# EAGLE schematic lcdTestBoard (EAGLE 7.3.0)
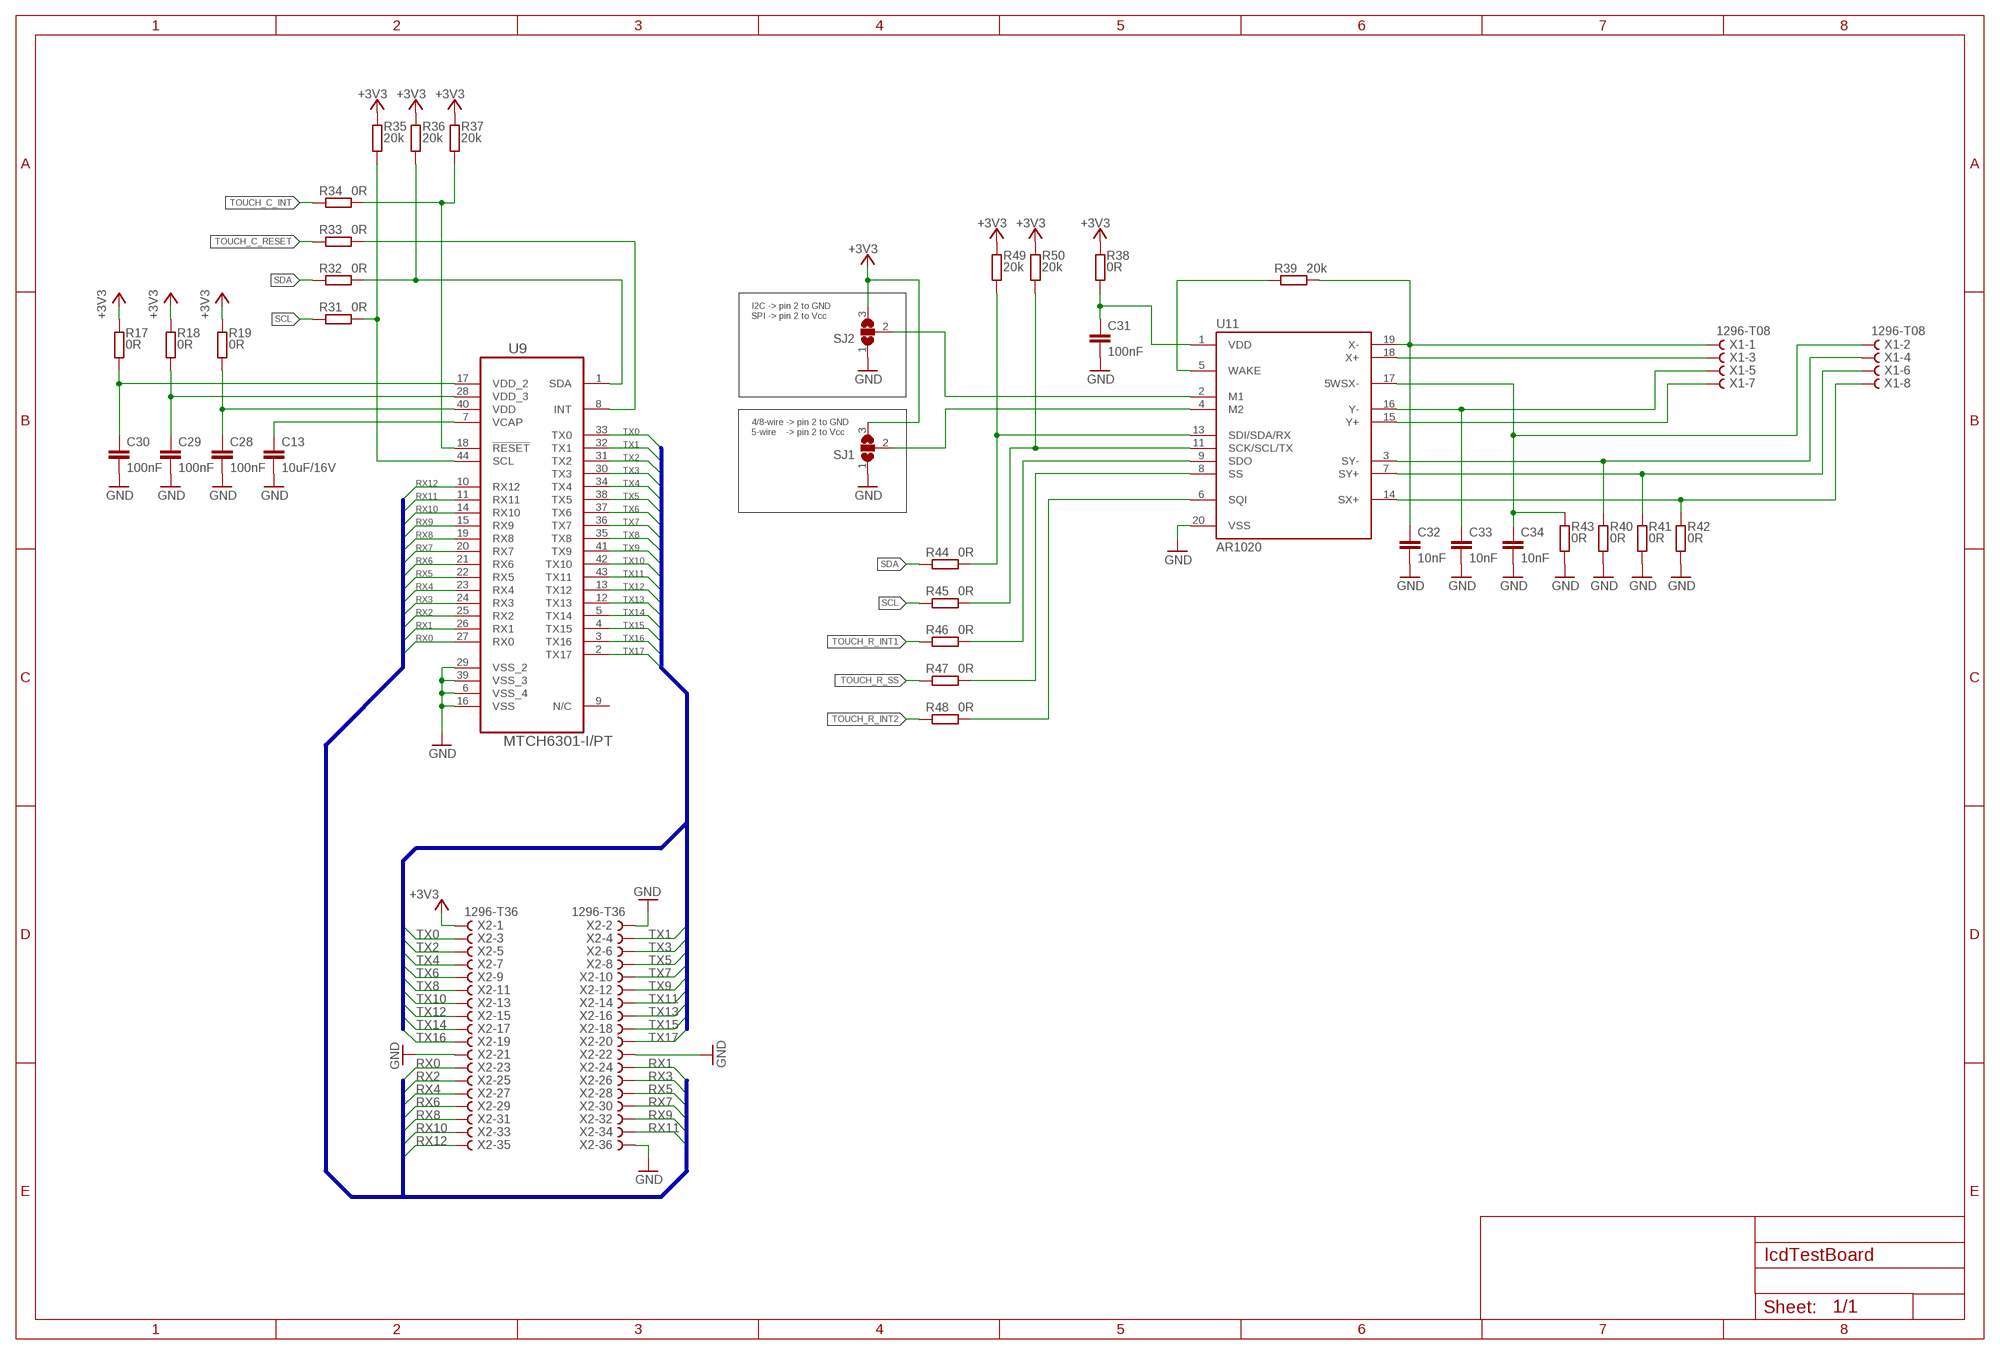
[diagram p0: schematic, sheet 1, part 1 of 3]
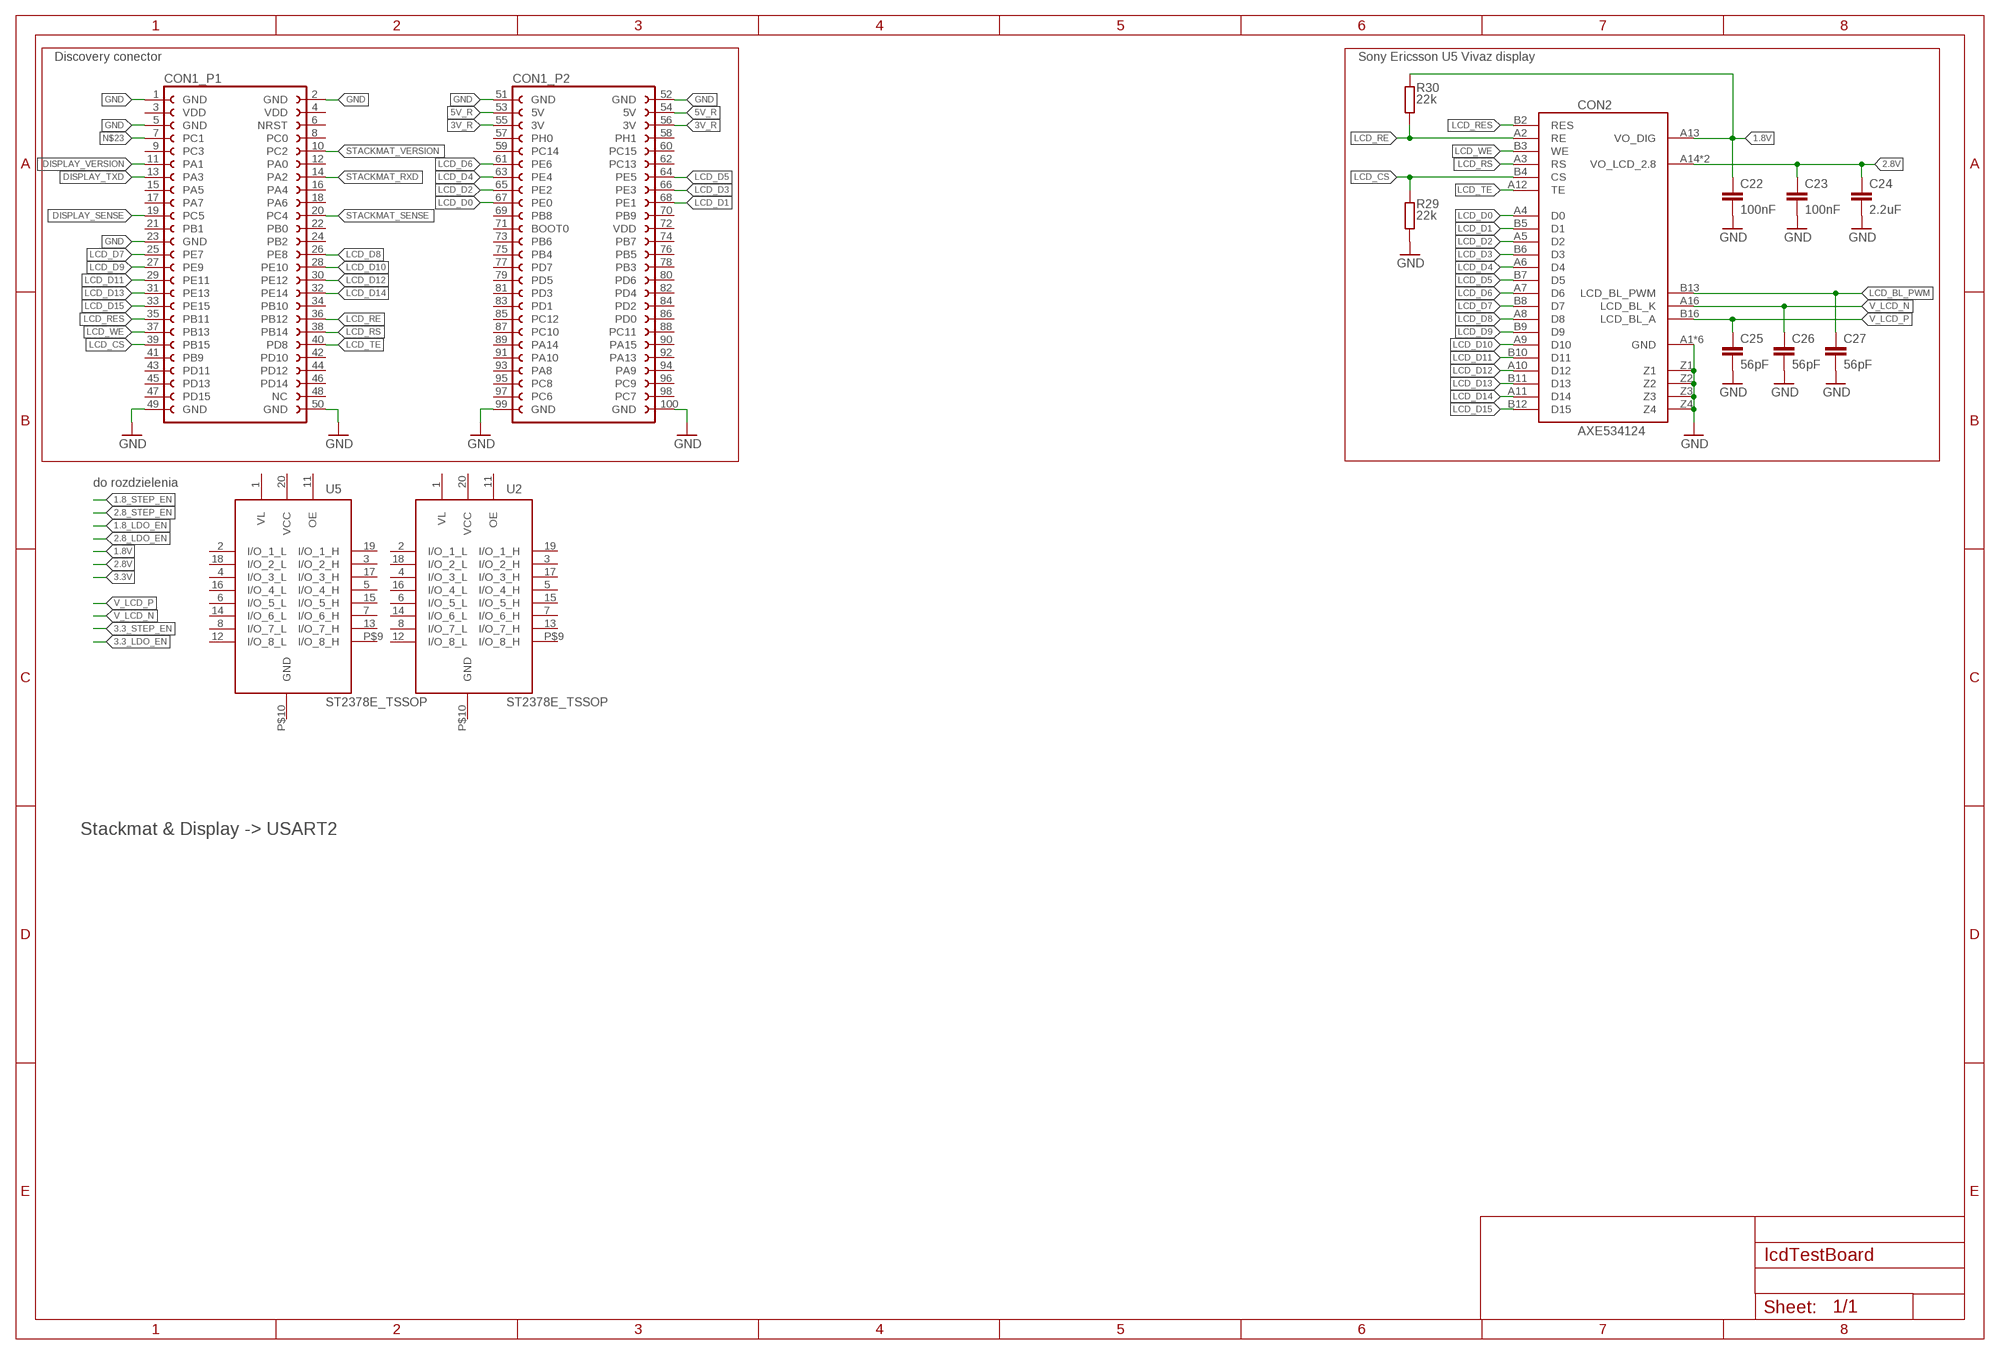
[diagram p1: schematic, sheet 1, part 2 of 3]
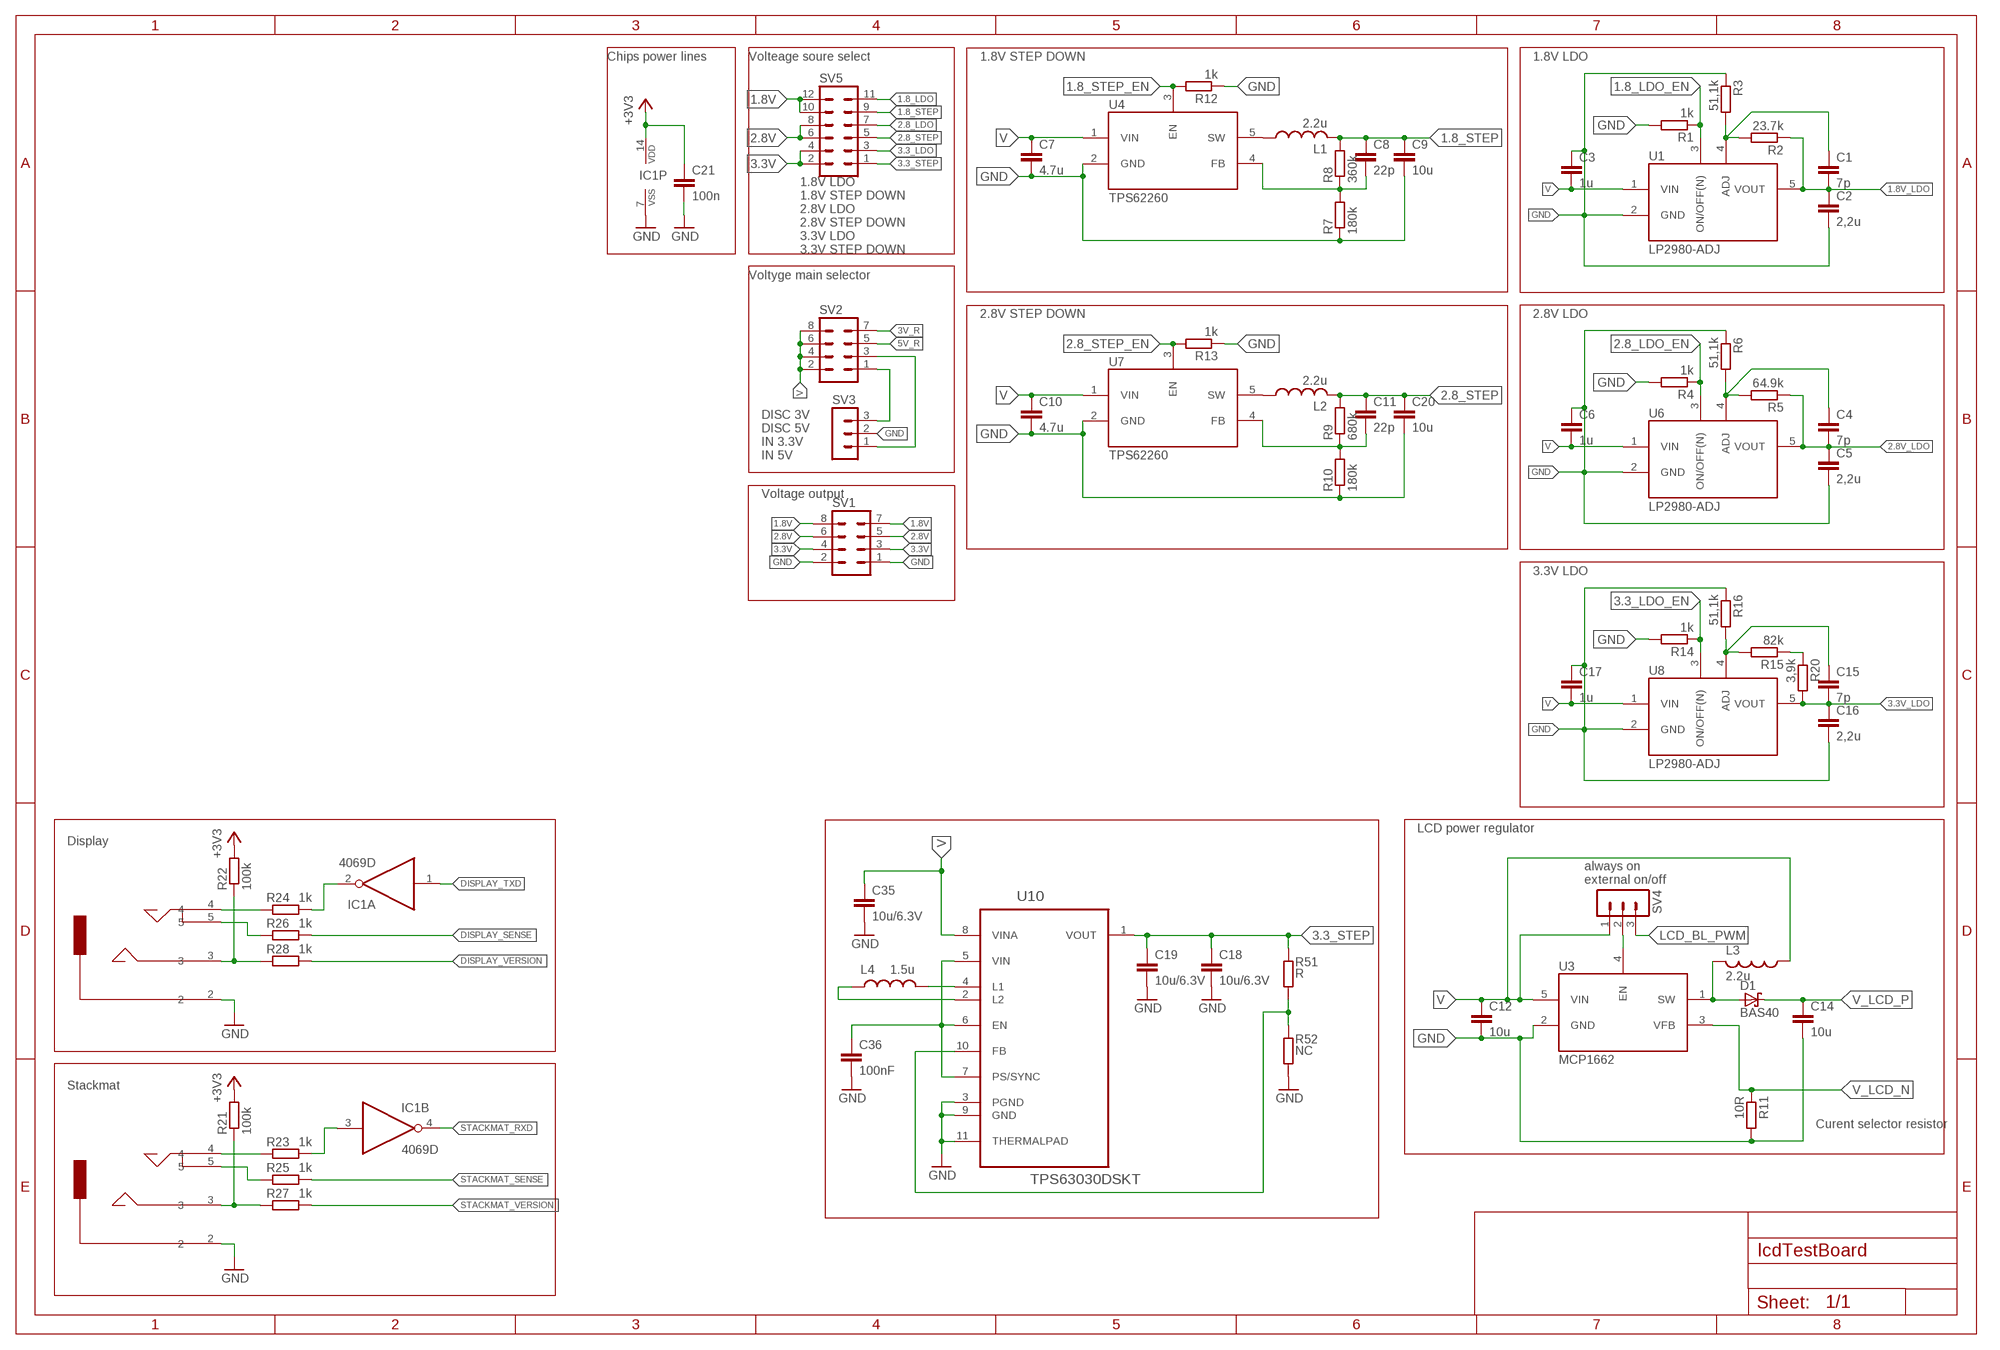
[diagram p2: schematic, sheet 1, part 3 of 3]

## Parts
C1  7p  C-EUC0603  [C0603]
C2  2,2u  C-EUC0603  [C0603]
C3  1u  C-EUC0603  [C0603]
C4  7p  C-EUC0603  [C0603]
C5  2,2u  C-EUC0603  [C0603]
C6  1u  C-EUC0603  [C0603]
C7  4.7u  C-EUC0603  [C0603]
C8  22p  C-EUC0603  [C0603]
C9  10u  C-EUC1206  [C1206]
C10  4.7u  C-EUC0603  [C0603]
C11  22p  C-EUC0603  [C0603]
C12  10u  C-EUC1206  [C1206]
C13  10uF/16V  C-EUC1206K  [C1206K]
C14  10u  C-EUC1206  [C1206]
C15  7p  C-EUC0603  [C0603]
C16  2,2u  C-EUC0603  [C0603]
C17  1u  C-EUC0603  [C0603]
C18  10u/6.3V  C-EUC1206  [C1206]
C19  10u/6.3V  C-EUC1206  [C1206]
C20  10u  C-EUC1206  [C1206]
C21  100n  C-EUC0603K  [C0603K]
C22  100nF  C-EUC0603K  [C0603K]
C23  100nF  C-EUC0603K  [C0603K]
C24  2.2uF  C-EUC0603K  [C0603K]
C25  56pF  C-EUC0603K  [C0603K]
C26  56pF  C-EUC0603K  [C0603K]
C27  56pF  C-EUC0603K  [C0603K]
C28  100nF  C-EUC0603K  [C0603K]
C29  100nF  C-EUC0603K  [C0603K]
C30  100nF  C-EUC0603K  [C0603K]
C31  100nF  C-EUC0603K  [C0603K]
C32  10nF  C-EUC0603K  [C0603K]
C33  10nF  C-EUC0603K  [C0603K]
C34  10nF  C-EUC0603K  [C0603K]
C35  10u/6.3V  C-EUC1206  [C1206]
C36  100nF  C-EUC1206  [C1206]
CON1  STM32F4DISCOVERY-CONNECTOR  [STM32F4DISCOVERY_CONNECTOR]
CON2  AXE534124  [SOCKET]
D1  BAS40  [SOT23]
IC1  4069D  [SO14]
L1  2.2u  L-USL2012C  [L2012C]
L2  2.2u  L-USL2012C  [L2012C]
L3  2.2u  L-USL2012C  [L2012C]
L4  1.5u  L-USL2012C  [L2012C]
R1  1k  R-EU_R0603  [R0603]
R2  23.7k  R-EU_R0603  [R0603]
R3  51,1k  R-EU_R0603  [R0603]
R4  1k  R-EU_R0603  [R0603]
R5  64.9k  R-EU_R0603  [R0603]
R6  51,1k  R-EU_R0603  [R0603]
R7  180k  R-EU_R0603  [R0603]
R8  360k  R-EU_R0603  [R0603]
R9  680k  R-EU_R0603  [R0603]
R10  180k  R-EU_R0603  [R0603]
R11  10R  R-EU_R0603  [R0603]
R12  1k  R-EU_R0603  [R0603]
R13  1k  R-EU_R0603  [R0603]
R14  1k  R-EU_R0603  [R0603]
R15  82k  R-EU_R0603  [R0603]
R16  51,1k  R-EU_R0603  [R0603]
R17  0R  R-EU_R0603  [R0603]
R18  0R  R-EU_R0603  [R0603]
R19  0R  R-EU_R0603  [R0603]
R20  3,9k  R-EU_R0603  [R0603]
R21  100k  R-EU_R0603  [R0603]
R22  100k  R-EU_R0603  [R0603]
R23  1k  R-EU_R0603  [R0603]
R24  1k  R-EU_R0603  [R0603]
R25  1k  R-EU_R0603  [R0603]
R26  1k  R-EU_R0603  [R0603]
R27  1k  R-EU_R0603  [R0603]
R28  1k  R-EU_R0603  [R0603]
R29  22k  R-EU_R0603  [R0603]
R30  22k  R-EU_R0603  [R0603]
R31  0R  R-EU_R0603  [R0603]
R32  0R  R-EU_R0603  [R0603]
R33  0R  R-EU_R0603  [R0603]
R34  0R  R-EU_R0603  [R0603]
R35  20k  R-EU_R0603  [R0603]
R36  20k  R-EU_R0603  [R0603]
R37  20k  R-EU_R0603  [R0603]
R38  0R  R-EU_R0603  [R0603]
R39  20k  R-EU_R0603  [R0603]
R40  0R  R-EU_R0603  [R0603]
R41  0R  R-EU_R0603  [R0603]
R42  0R  R-EU_R0603  [R0603]
R43  0R  R-EU_R0603  [R0603]
R44  0R  R-EU_R0603  [R0603]
R45  0R  R-EU_R0603  [R0603]
R46  0R  R-EU_R0603  [R0603]
R47  0R  R-EU_R0603  [R0603]
R48  0R  R-EU_R0603  [R0603]
R49  20k  R-EU_R0603  [R0603]
R50  20k  R-EU_R0603  [R0603]
R51  R  R-EU_R0603  [R0603]
R52  NC  R-EU_R0603  [R0603]
SJ1  SJ2W  [SJ_2]
SJ2  SJ2W  [SJ_2]
SV1  MA04-2  [MA04-2]
SV2  MA04-2  [MA04-2]
SV3  MA03-1  [MA03-1]
SV4  MA03-1  [MA03-1]
SV5  MA06-2  [MA06-2]
U1  LP2980-ADJ  [SOT-23]
U2  ST2378E_TSSOP  [TSSOP20]
U3  MCP1662  [SOT-23]
U4  TPS62260  [SOT-23]
U5  ST2378E_TSSOP  [TSSOP20]
U6  LP2980-ADJ  [SOT-23]
U7  TPS62260  [SOT-23]
U8  LP2980-ADJ  [SOT-23]
U9  MTCH6301-I/PT  [TQFP80P1200X1200X120-44N]
U10  TPS63030DSKT  [SON50P260X260X80-11N]
U11  AR1020  [SSOP20]
U$1  PJST19GL50  [MODEL1]
U$2  PJST19GL50  [MODEL1]
X1  1296-T08  [1296-08]
X2  1296-T36  [1296-36]

## Nets
1.8_LDO: SV5.11
1.8_LDO_EN: R1.1 U1.3(ON/OFF(N))
1.8_STEP: C8.1 C9.1 L1.2 R8.2 SV5.9
1.8_STEP_EN: R12.2 U4.3(EN)
1.8V: C22.1 CON2.A13(VO_DIG) R30.1 SV1.7 SV1.8 SV5.10 SV5.12
1.8V_LDO: C1.2 C2.1 R2.1 U1.5(VOUT)
2.8_LDO: SV5.7
2.8_LDO_EN: R4.1 U6.3(ON/OFF(N))
2.8_STEP: C11.1 C20.1 L2.2 R9.2 SV5.5
2.8_STEP_EN: R13.2 U7.3(EN)
2.8V: C23.1 C24.1 CON2.A14(VO_LCD_2.8) CON2.B14(VO_LCD_2.8) SV1.5 SV1.6 SV5.6 SV5.8
2.8V_LDO: C4.2 C5.1 R5.1 U6.5(VOUT)
3.3_LDO: SV5.3
3.3_LDO_EN: R14.1 U8.3(ON/OFF(N))
3.3_STEP: C18.1 C19.1 R51.1 SV5.1 U10.1(VOUT)
3.3V: SV1.3 SV1.4 SV5.2 SV5.4
3.3V_LDO: C15.2 C16.1 R20.2 U8.5(VOUT)
3V_R: CON1.55(_P2:3V) CON1.56(_P2:3V) SV2.7
5V_R: CON1.53(_P2:5V) CON1.54(_P2:5V) SV2.5
+3V3: C21.1 IC1.14(P:VDD) R17.1 R18.1 R19.1 R21.2 R22.2 R35.1 R36.1 R37.1 R38.1 R49.1 R50.1 SJ1.3 SJ2.3 X2.1
DISPLAY_SENSE: CON1.19(_P1:PC5) R26.1
DISPLAY_TXD: CON1.13(_P1:PA3) IC1.1(A:I)
DISPLAY_VERSION: CON1.11(_P1:PA1) R28.1
GND: C2.2 C3.1 C5.2 C6.1 C7.2 C9.2 C10.2 C12.2 C13.2 C14.2 C16.2 C17.1 C18.2 C19.2 C20.2 C21.2 C22.2 C23.2 C24.2 C25.2 C26.2 C27.2 C28.2 C29.2 C30.2 C31.2 C32.2 C33.2 C34.2 C35.2 C36.2 CON1.1(_P1:GND) CON1.2(_P1:GND) CON1.5(_P1:GND) CON1.23(_P1:GND) CON1.49(_P1:GND) CON1.50(_P1:GND) CON1.51(_P2:GND) CON1.52(_P2:GND) CON1.99(_P2:GND) CON1.100(_P2:GND) CON2.A1(GND) CON2.A15(GND) CON2.A17(GND) CON2.B1(GND) CON2.B15(GND) CON2.B17(GND) CON2.Z1 CON2.Z2 CON2.Z3 CON2.Z4 IC1.7(P:VSS) R1.2 R3.1 R4.2 R6.1 R7.1 R10.1 R11.2 R12.1 R13.1 R14.2 R16.1 R29.2 R40.2 R41.2 R42.2 R43.2 R52.2 SJ1.1 SJ2.1 SV1.1 SV1.2 SV2.1 SV3.3 U1.2(GND) U3.2(GND) U4.2(GND) U6.2(GND) U7.2(GND) U8.2(GND) U9.6(VSS_4) U9.16(VSS) U9.29(VSS_2) U9.39(VSS_3) U10.3(PGND) U10.9(GND) U10.11(THERMALPAD) U11.20(VSS) U$1.2 U$2.2 X2.2 X2.21 X2.22 X2.36
LCD_BL_PWM: C27.1 CON2.B13(LCD_BL_PWM) SV4.3
LCD_CS: CON1.39(_P1:PB15) CON2.B4(CS) R29.1
LCD_D0: CON1.67(_P2:PE0) CON2.A4(D0)
LCD_D1: CON1.68(_P2:PE1) CON2.B5(D1)
LCD_D2: CON1.65(_P2:PE2) CON2.A5(D2)
LCD_D3: CON1.66(_P2:PE3) CON2.B6(D3)
LCD_D4: CON1.63(_P2:PE4) CON2.A6(D4)
LCD_D5: CON1.64(_P2:PE5) CON2.B7(D5)
LCD_D6: CON1.61(_P2:PE6) CON2.A7(D6)
LCD_D7: CON1.25(_P1:PE7) CON2.B8(D7)
LCD_D8: CON1.26(_P1:PE8) CON2.A8(D8)
LCD_D9: CON1.27(_P1:PE9) CON2.B9(D9)
LCD_D10: CON1.28(_P1:PE10) CON2.A9(D10)
LCD_D11: CON1.29(_P1:PE11) CON2.B10(D11)
LCD_D12: CON1.30(_P1:PE12) CON2.A10(D12)
LCD_D13: CON1.31(_P1:PE13) CON2.B11(D13)
LCD_D14: CON1.32(_P1:PE14) CON2.A11(D14)
LCD_D15: CON1.33(_P1:PE15) CON2.B12(D15)
LCD_RE: CON1.36(_P1:PB12) CON2.A2(RE) R30.2
LCD_RES: CON1.35(_P1:PB11) CON2.B2(RES)
LCD_RS: CON1.38(_P1:PB14) CON2.A3(RS)
LCD_TE: CON1.40(_P1:PD8) CON2.A12(TE)
LCD_WE: CON1.37(_P1:PB13) CON2.B3(WE)
N$1: C15.1 R15.2 R16.2 U8.4(ADJ)
N$2: L2.1 U7.5(SW)
N$3: C1.1 R2.2 R3.2 U1.4(ADJ)
N$4: C11.2 R9.1 R10.2 U7.4(FB)
N$5: L1.1 U4.5(SW)
N$6: L4.1 U10.2(L2)
N$7: SV2.3 SV3.1
N$8: C4.1 R5.2 R6.2 U6.4(ADJ)
N$9: L4.2 U10.4(L1)
N$10: C8.2 R7.2 R8.1 U4.4(FB)
N$11: R15.1 R20.1
N$12: SV4.2 U3.4(EN)
N$13: D1.1(A) L3.2 U3.1(SW)
N$14: R22.1 R28.2 U$2.3
N$15: R21.1 R27.2 U$1.3
N$16: R24.2 U$2.4
N$17: R23.2 U$1.4
N$18: R26.2 U$2.5
N$19: R25.2 U$1.5
N$20: IC1.2(A:O) R24.1
N$21: IC1.3(B:I) R23.1
N$22: C13.1 U9.7(VCAP)
N$23: CON1.7(_P1:PC1)
N$24: C28.1 R19.2 U9.40(VDD)
N$25: C29.1 R18.2 U9.28(VDD_3)
N$26: C30.1 R17.2 U9.17(VDD_2)
N$27: R31.1 R35.2 U9.44(SCL)
N$28: R34.1 R37.2 U9.18(!RESET)
N$29: R32.1 R36.2 U9.1(SDA)
N$30: R33.1 U9.8(INT)
N$32: R51.2 R52.1 U10.10(FB)
N$35: C31.1 R38.2 U11.1(VDD)
N$36: R39.2 U11.5(WAKE)
N$37: C32.1 R39.1 U11.19(X-) X1.1
N$38: C33.1 U11.16(Y-) X1.5
N$39: C34.1 R43.1 U11.17(5WSX-) X1.2
N$40: U11.18(X+) X1.3
N$41: U11.15(Y+) X1.7
N$42: R40.1 U11.3(SY-) X1.4
N$43: R41.1 U11.7(SY+) X1.6
N$44: R42.1 U11.14(SX+) X1.8
N$45: SJ2.2 U11.2(M1)
N$46: SJ1.2 U11.4(M2)
N$48: R44.1 R49.2 U11.13(SDI/SDA/RX)
N$49: R45.1 R50.2 U11.11(SCK/SCL/TX)
N$50: R46.1 U11.9(SDO)
N$51: R47.1 U11.8(SS)
N$52: R48.1 U11.6(SQI)
RX0: U9.27(RX0) X2.23
RX1: U9.26(RX1) X2.24
RX2: U9.25(RX2) X2.25
RX3: U9.24(RX3) X2.26
RX4: U9.23(RX4) X2.27
RX5: U9.22(RX5) X2.28
RX6: U9.21(RX6) X2.29
RX7: U9.20(RX7) X2.30
RX8: U9.19(RX8) X2.31
RX9: U9.15(RX9) X2.32
RX10: U9.14(RX10) X2.33
RX11: U9.11(RX11) X2.34
RX12: U9.10(RX12) X2.35
SCL: R31.2 R45.2
SDA: R32.2 R44.2
STACKMAT_RXD: CON1.14(_P1:PA2) IC1.4(B:O)
STACKMAT_SENSE: CON1.20(_P1:PC4) R25.1
STACKMAT_VERSION: CON1.10(_P1:PC2) R27.1
TOUCH_C_INT: R34.2
TOUCH_C_RESET: R33.2
TOUCH_R_INT1: R46.2
TOUCH_R_INT2: R48.2
TOUCH_R_SS: R47.2
TX0: U9.33(TX0) X2.3
TX1: U9.32(TX1) X2.4
TX2: U9.31(TX2) X2.5
TX3: U9.30(TX3) X2.6
TX4: U9.34(TX4) X2.7
TX5: U9.38(TX5) X2.8
TX6: U9.37(TX6) X2.9
TX7: U9.36(TX7) X2.10
TX8: U9.35(TX8) X2.11
TX9: U9.41(TX9) X2.12
TX10: U9.42(TX10) X2.13
TX11: U9.43(TX11) X2.14
TX12: U9.13(TX12) X2.15
TX13: U9.12(TX13) X2.16
TX14: U9.5(TX14) X2.17
TX15: U9.4(TX15) X2.18
TX16: U9.3(TX16) X2.19
TX17: U9.2(TX17) X2.20
V: C3.2 C6.2 C7.1 C10.1 C12.1 C17.2 C35.1 C36.1 L3.1 SV2.2 SV2.4 SV2.6 SV2.8 SV4.1 U1.1(VIN) U3.5(VIN) U4.1(VIN) U6.1(VIN) U7.1(VIN) U8.1(VIN) U10.5(VIN) U10.6(EN) U10.7(PS/SYNC) U10.8(VINA)
V_LCD_N: C26.1 CON2.A16(LCD_BL_K) R11.1 U3.3(VFB)
V_LCD_P: C14.1 C25.1 CON2.B16(LCD_BL_A) D1.3(C)
Unconnected: CON1.3(_P1:VDD) CON1.4(_P1:VDD) CON1.6(_P1:NRST) CON1.8(_P1:PC0) CON1.9(_P1:PC3) CON1.12(_P1:PA0) CON1.15(_P1:PA5) CON1.16(_P1:PA4) CON1.17(_P1:PA7) CON1.18(_P1:PA6) CON1.21(_P1:PB1) CON1.22(_P1:PB0) CON1.24(_P1:PB2) CON1.34(_P1:PB10) CON1.41(_P1:PB9) CON1.42(_P1:PD10) CON1.43(_P1:PD11) CON1.44(_P1:PD12) CON1.45(_P1:PD13) CON1.46(_P1:PD14) CON1.47(_P1:PD15) CON1.48(_P1:NC) CON1.57(_P2:PH0) CON1.58(_P2:PH1) CON1.59(_P2:PC14) CON1.60(_P2:PC15) CON1.62(_P2:PC13) CON1.69(_P2:PB8) CON1.70(_P2:PB9) CON1.71(_P2:BOOT0) CON1.72(_P2:VDD) CON1.73(_P2:PB6) CON1.74(_P2:PB7) CON1.75(_P2:PB4) CON1.76(_P2:PB5) CON1.77(_P2:PD7) CON1.78(_P2:PB3) CON1.79(_P2:PD5) CON1.80(_P2:PD6) CON1.81(_P2:PD3) CON1.82(_P2:PD4) CON1.83(_P2:PD1) CON1.84(_P2:PD2) CON1.85(_P2:PC12) CON1.86(_P2:PD0) CON1.87(_P2:PC10) CON1.88(_P2:PC11) CON1.89(_P2:PA14) CON1.90(_P2:PA15) CON1.91(_P2:PA10) CON1.92(_P2:PA13) CON1.93(_P2:PA8) CON1.94(_P2:PA9) CON1.95(_P2:PC8) CON1.96(_P2:PC9) CON1.97(_P2:PC6) CON1.98(_P2:PC7) IC1.5(C:I) IC1.6(C:O) IC1.8(D:O) IC1.9(D:I) IC1.10(E:O) IC1.11(E:I) IC1.12(F:O) IC1.13(F:I) SV3.2 U2.1(VL) U2.2(I/O_1_L) U2.3(I/O_2_H) U2.4(I/O_3_L) U2.5(I/O_4_H) U2.6(I/O_5_L) U2.7(I/O_6_H) U2.8(I/O_7_L) U2.11(OE) U2.12(I/O_8_L) U2.13(I/O_7_H) U2.14(I/O_6_L) U2.15(I/O_5_H) U2.16(I/O_4_L) U2.17(I/O_3_H) U2.18(I/O_2_L) U2.19(I/O_1_H) U2.20(VCC) U2.P$9(I/O_8_H) U2.P$10(GND) U5.1(VL) U5.2(I/O_1_L) U5.3(I/O_2_H) U5.4(I/O_3_L) U5.5(I/O_4_H) U5.6(I/O_5_L) U5.7(I/O_6_H) U5.8(I/O_7_L) U5.11(OE) U5.12(I/O_8_L) U5.13(I/O_7_H) U5.14(I/O_6_L) U5.15(I/O_5_H) U5.16(I/O_4_L) U5.17(I/O_3_H) U5.18(I/O_2_L) U5.19(I/O_1_H) U5.20(VCC) U5.P$9(I/O_8_H) U5.P$10(GND) U9.9(N/C)

## Buses
RX0,RX1,RX2,RX3,RX4,RX5,RX6,RX7,RX8,RX9,RX10,RX11,RX12
TX0,TX1,TX2,TX3,TX4,TX5,TX6,TX7,TX8,TX9,TX10,TX11,TX12,TX13,TX14,TX15,TX16,TX17

## Notes on the sheet
- I2C -> pin 2 to GND
  SPI -> pin 2 to Vcc
- 4/8-wire -> pin 2 to GND
  5-wire    -> pin 2 to Vcc
- Discovery conector | Sony Ericsson U5 Vivaz display | Chips power lines | Volteage soure select | 1.8V STEP DOWN | 1.8V LDO
- 1.8V LDO
  1.8V STEP DOWN
  2.8V LDO
  2.8V STEP DOWN
  3.3V LDO
  3.3V STEP DOWN
- Voltyge main selector
- 2.8V STEP DOWN | 2.8V LDO
- DISC 3V
  DISC 5V
  IN 3.3V
  IN 5V
- do rozdzielenia
- Voltage output
- 3.3V LDO
- Stackmat & Display -> USART2 | LCD power regulator
- Display
- always on
  external on/off
- Stackmat
- Curent selector resistor

## Library data of the parts
C1-C36 = rcl:C-EU: CAPACITOR, European symbol
CON1 = stm32f4Discovery_connector:STM32F4DISCOVERY-CONNECTOR
CON2 = con_AXE534124:AXE534124
D1 = diode:BAS40: Silicon Schottky Diodes General-purpose diode for high-speed switching
IC1 = 40xx:4069: Hex INVERTER
L1-L4 = rcl:L-US: INDUCTOR, American symbol
R1-R52 = rcl:R-EU_: RESISTOR, European symbol
SJ1 SJ2 = jumper:SJ2W: SMD solder JUMPER
SV1 SV2 = con-lstb:MA04-2: PIN HEADER; OC_FARNELL: unknown; OC_NEWARK: unknown
SV3 SV4 = con-lstb:MA03-1: PIN HEADER; OC_FARNELL: unknown; OC_NEWARK: unknown
SV5 = con-lstb:MA06-2: PIN HEADER; OC_FARNELL: unknown; OC_NEWARK: unknown
U1 U6 U8 = LP2980:LP2980-ADJ
U2 U5 = ST2378E:ST2378E_TSSOP
U3 = MCP1662:MCP1662
U4 U7 = TPS6226x:TPS62260
U9 = mtch6301:MTCH6301-I/PT: IC, TOUCH CTRLR, 44TQFP; MPN: MTCH6301-I/PT; OC_FARNELL: 2301095; OC_NEWARK: 69W0668; PACKAGE: 44TQFP; SUPPLIER: Microchip
U10 = tps6303030:TPS63030DSKT: HIGH EFFICIENCY SINGLE INDUCTOR BUCK-BOOST CONVERTER WITH 1-A SWITCHES; MPN: TPS63030DSKT; OC_FARNELL: 1686303; OC_NEWARK: 19P7478; PACKAGE: SON-10; SUPPLIER: Texas Instruments
U11 = AR1020:AR1020
U$1 U$2 = con_jack_2.5:PJST19GL50
X1 = con-leotronics:1296-T08: 1.27mm SINGLE ROW FEMALE SOCKET Source: http://www.leotronics.co.uk/Conexcon/Data%20Sheets/sec.%20A/1296ing.pdf; OC_FARNELL: unknown; OC_NEWARK: unknown
X2 = con-leotronics:1296-T36: 1.27mm SINGLE ROW FEMALE SOCKET Source: http://www.leotronics.co.uk/Conexcon/Data%20Sheets/sec.%20A/1296ing.pdf; OC_FARNELL: unknown; OC_NEWARK: unknown